# Altium schematic sheet TOP.SchDoc: Okos otthon vezérlő HAT
size A4; Author: Bencsik Dániel Zoltán; Organization: BME VIK AUT; DocumentNumber: 1; SheetNumber: 1; SheetTotal: 4
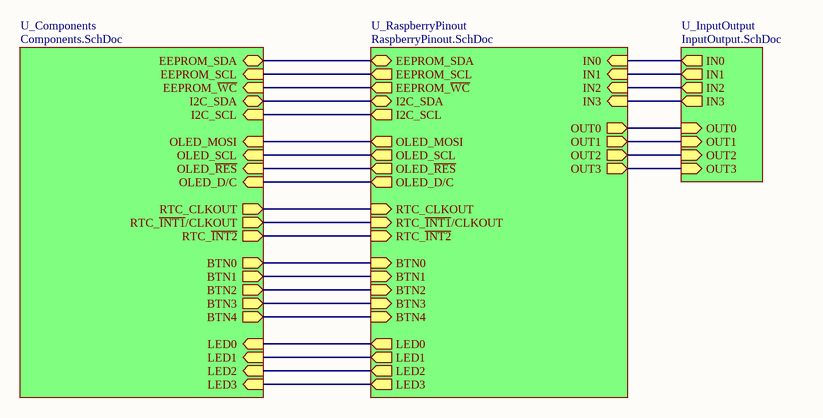
[diagram p0: TOP.SchDoc]

## Sub-sheets
U_Components = Components.SchDoc: EEPROM_SDA (bidir), EEPROM_SCL (in), EEPROM_~{WC} (in), RTC_~{INT1}/CLKOUT (out), RTC_CLKOUT (out), RTC_~{INT2} (out), LED0 (in), LED1 (in), LED2 (in), LED3 (in), BTN0 (out), BTN1 (out), BTN2 (out), BTN3 (out), BTN4 (out), OLED_SCL (in), OLED_MOSI (in), OLED_~{RES} (in), OLED_D/C (in), I2C_SCL (in), I2C_SDA (bidir)
U_InputOutput = InputOutput.SchDoc: IN0 (out), IN1 (out), IN2 (out), IN3 (out), OUT0 (in), OUT1 (in), OUT2 (in), OUT3 (in)
U_RaspberryPinout = RaspberryPinout.SchDoc: EEPROM_SDA (bidir), EEPROM_SCL (out), IN3 (in), IN2 (in), IN1 (in), IN0 (in), EEPROM_~{WC} (out), RTC_CLKOUT (in), RTC_~{INT1}/CLKOUT (in), BTN4 (in), BTN3 (in), BTN2 (in), BTN1 (in), BTN0 (in), RTC_~{INT2} (in), OLED_SCL (out), OLED_~{RES} (out), OLED_D/C (out), OLED_MOSI (out), LED3 (out), LED2 (out), LED1 (out), LED0 (out), I2C_SDA (bidir), I2C_SCL (out), OUT0 (out), OUT1 (out), OUT2 (out), OUT3 (out)

## Nets
(unnamed): sheet U_RaspberryPinout/EEPROM_SDA, sheet U_Components/EEPROM_SDA
(unnamed): sheet U_RaspberryPinout/EEPROM_SCL, sheet U_Components/EEPROM_SCL
(unnamed): sheet U_RaspberryPinout/IN3, sheet U_InputOutput/IN3
(unnamed): sheet U_RaspberryPinout/IN2, sheet U_InputOutput/IN2
(unnamed): sheet U_RaspberryPinout/IN1, sheet U_InputOutput/IN1
(unnamed): sheet U_RaspberryPinout/IN0, sheet U_InputOutput/IN0
(unnamed): sheet U_RaspberryPinout/EEPROM_~{WC}, sheet U_Components/EEPROM_~{WC}
(unnamed): sheet U_RaspberryPinout/RTC_CLKOUT, sheet U_Components/RTC_CLKOUT
(unnamed): sheet U_RaspberryPinout/RTC_~{INT1}/CLKOUT, sheet U_Components/RTC_~{INT1}/CLKOUT
(unnamed): sheet U_RaspberryPinout/BTN4, sheet U_Components/BTN4
(unnamed): sheet U_RaspberryPinout/BTN3, sheet U_Components/BTN3
(unnamed): sheet U_RaspberryPinout/BTN2, sheet U_Components/BTN2
(unnamed): sheet U_RaspberryPinout/BTN1, sheet U_Components/BTN1
(unnamed): sheet U_RaspberryPinout/BTN0, sheet U_Components/BTN0
(unnamed): sheet U_RaspberryPinout/RTC_~{INT2}, sheet U_Components/RTC_~{INT2}
(unnamed): sheet U_RaspberryPinout/OLED_SCL, sheet U_Components/OLED_SCL
(unnamed): sheet U_RaspberryPinout/OLED_~{RES}, sheet U_Components/OLED_~{RES}
(unnamed): sheet U_RaspberryPinout/OLED_D/C, sheet U_Components/OLED_D/C
(unnamed): sheet U_RaspberryPinout/OLED_MOSI, sheet U_Components/OLED_MOSI
(unnamed): sheet U_RaspberryPinout/LED3, sheet U_Components/LED3
(unnamed): sheet U_RaspberryPinout/LED2, sheet U_Components/LED2
(unnamed): sheet U_RaspberryPinout/LED1, sheet U_Components/LED1
(unnamed): sheet U_RaspberryPinout/LED0, sheet U_Components/LED0
(unnamed): sheet U_RaspberryPinout/I2C_SDA, sheet U_Components/I2C_SDA
(unnamed): sheet U_RaspberryPinout/I2C_SCL, sheet U_Components/I2C_SCL
(unnamed): sheet U_RaspberryPinout/OUT0, sheet U_InputOutput/OUT0
(unnamed): sheet U_RaspberryPinout/OUT1, sheet U_InputOutput/OUT1
(unnamed): sheet U_RaspberryPinout/OUT2, sheet U_InputOutput/OUT2
(unnamed): sheet U_RaspberryPinout/OUT3, sheet U_InputOutput/OUT3

## Notes on the sheet
- Title
- Size:
- Date:
- A4
- Number:
- Time:
- Revision:
- Sheet
- of
- File: